# Altium schematic sheet PowerB.SchDoc
size A
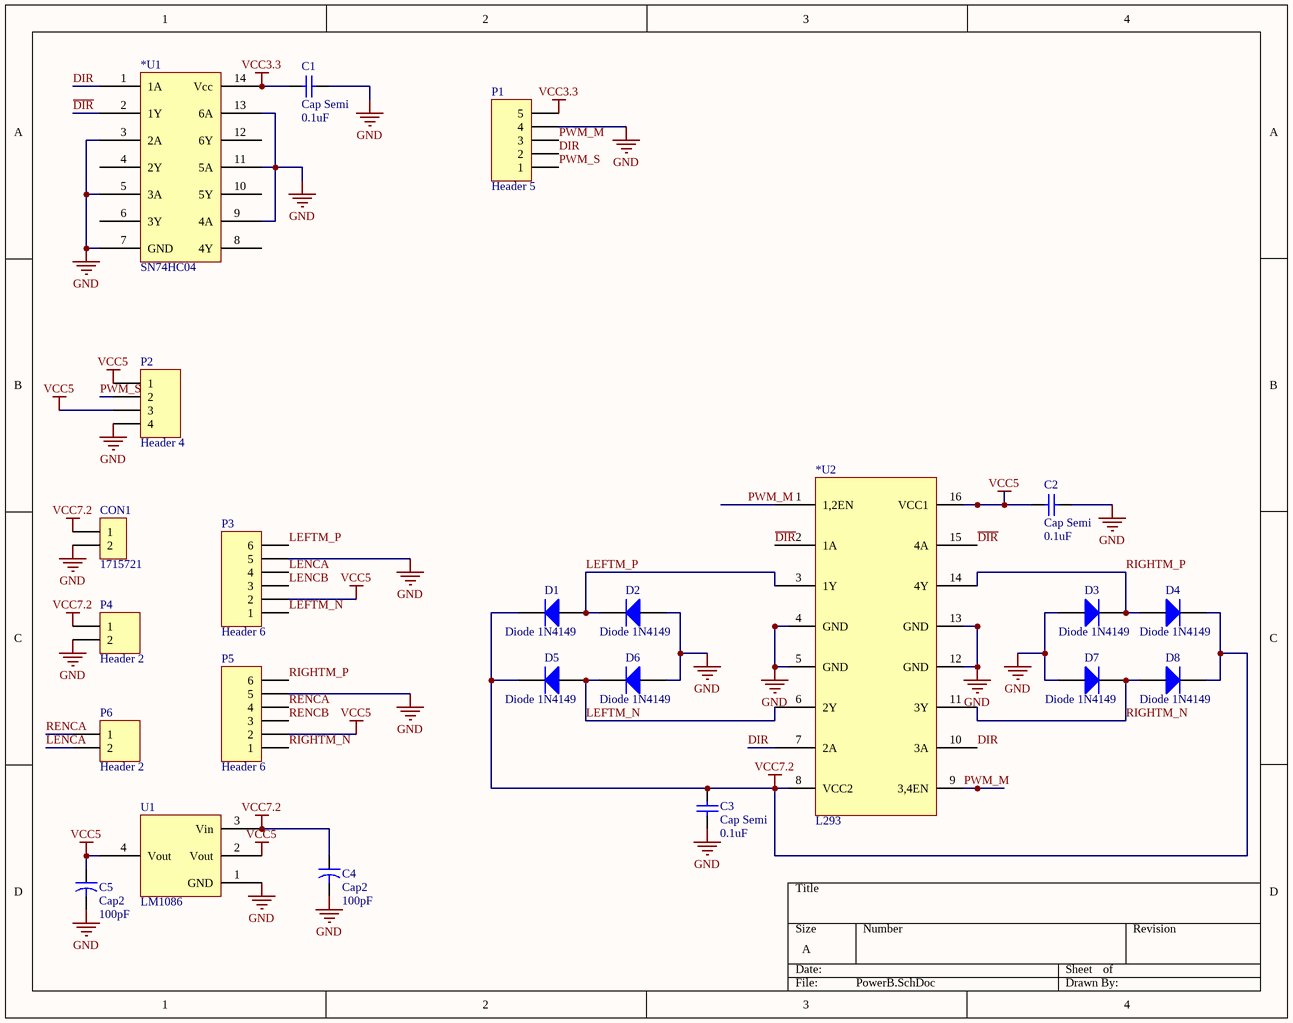
[diagram p0: PowerB.SchDoc]

## Parts
*U1  SN74HC04  [DIP14]
*U2  L293  [DIP16]
C1  Cap Semi  value 0.1uF  [C1206]
C2  Cap Semi  value 0.1uF  [C1206]
C3  Cap Semi  value 0.1uF  [C1206]
C4  Cap2  value 100pF  [100EFK]
C5  Cap2  value 100pF  [100EFK]
CON1  1715721  [1715721]
D1  Diode 1N4149  [DO-35A]
D2  Diode 1N4149  [DO-35A]
D3  Diode 1N4149  [DO-35A]
D4  Diode 1N4149  [DO-35A]
D5  Diode 1N4149  [DO-35A]
D6  Diode 1N4149  [DO-35A]
D7  Diode 1N4149  [DO-35A]
D8  Diode 1N4149  [DO-35A]
P1  Header 5  [HDR1X5]
P2  Header 4  [HDR1X4]
P3  Header 6  [HDR1X6]
P4  Header 2  [HDR1X2]
P5  Header 6  [HDR1X6]
P6  Header 2  [HDR1X2]
U1  LM1086  [DPAK254]

## Nets
GND: *U1.3(2A) *U1.5(3A) *U1.7(GND) *U1.9(4A) *U1.11(5A) *U1.13(6A) *U2.4(GND) *U2.5(GND) *U2.12(GND) *U2.13(GND) C1.2 C2.1 C3.1 C4.2 C5.2 CON1.2 D2.1(A) D3.1(A) D6.1(A) D7.1(A) P1.4 P2.4 P3.5 P4.2 P5.5 U1.1(GND)
VCC3.3: *U1.14(Vcc) C1.1 P1.5
VCC5: *U2.16(VCC1) C2.2 C5.1 P2.1 P2.3 P3.2 P5.2 U1.2(Vout) U1.4(Vout)
VCC7.2: *U2.8(VCC2) C3.2 C4.1 CON1.1 D1.2(K) D4.2(K) D5.2(K) D8.2(K) P4.1 U1.3(Vin)
~{DIR}: *U1.2(1Y) *U2.2(1A) *U2.15(4A)
DIR: *U1.1(1A) *U2.7(2A) *U2.10(3A) P1.2
LEFTM_N: *U2.6(2Y) D5.1(A) D6.2(K) P3.1
LEFTM_P: *U2.3(1Y) D1.1(A) D2.2(K) P3.6
LENCA: P3.4 P6.2
LENCB: P3.3
PWM_M: *U2.1(1,2EN) *U2.9(3,4EN) P1.3
PWM_S: P1.1 P2.2
RENCA: P5.4 P6.1
RENCB: P5.3
RIGHTM_N: *U2.11(3Y) D7.2(K) D8.1(A) P5.1
RIGHTM_P: *U2.14(4Y) D3.2(K) D4.1(A) P5.6

Not connected (* = marked no-connect by the designer): *U1 4(2Y) 6(3Y) 8(4Y) 10(5Y) 12(6Y)

## Library data of the parts
C1-C3 = Cap Semi: Capacitor (Semiconductor SIM Model); Published: 8-Jun-2000; LatestRevisionDate: 29-May-2009; LatestRevisionNote: IPC-7351 Footprint Added.; PackageReference: C1206; Publisher: Altium Limited; PackageDescription: Chip Capacitor
C4 C5 = Cap2: Capacitor; Published: 23-Sep-2002; PackageReference: CAPR5-4X5; Publisher: Altium Limited; PackageDescription: Capacitor; 2 Leads
CON1 = 1715721: Conn Term (screw) Block 5mm 2Pos 18mm height; Digikey Part Number: 277-1022-ND
D1-D8 = Diode 1N4007: 1 Amp General Purpose Rectifier; Published: 8-Jun-2000; LatestRevisionDate: 17-Jul-2002; LatestRevisionNote: Re-released for DXP Platform.; DatasheetVersion: 1998; PackageVersion: Aug-1999; PackageReference: DO-41; Publisher: Altium Limited; PackageDescription: Diode, Axial; Body 5.2 x 2.7 mm (LxDia. max), Lead Dia. 0.86 mm (max); Code_JEDEC: DO-204-AL; ComponentLink1Description: Manufacturer Link; ComponentLink1URL: http://www.fairchildsemi.com/; ComponentLink2Description: Datasheet; ComponentLink2URL: http://www.fairchildsemi.com/ds/1N%2F1N4001.pdf
P1 = Header 5: Header, 5-Pin; LatestRevisionDate: 17-Jul-2002; LatestRevisionNote: Re-released for DXP Platform.; Publisher: Altium Limited
P2 = Header 4: Header, 4-Pin; LatestRevisionDate: 17-Jul-2002; LatestRevisionNote: Re-released for DXP Platform.; Publisher: Altium Limited
P3 P5 = Header 6: Header, 6-Pin; LatestRevisionDate: 17-Jul-2002; LatestRevisionNote: Re-released for DXP Platform.; Publisher: Altium Limited
P4 P6 = Header 2: Header, 2-Pin; LatestRevisionDate: 17-Jul-2002; LatestRevisionNote: Re-released for DXP Platform.; Publisher: Altium Limited